# Altium schematic sheet SCH-00001-AB-01.SchDoc: POWER CIRCUIT
size 431 x 279 mm; Date: 17/09/2024; DrawnBy: VARUN CHAKRAVARTHY; Engineer: VARUN CHAKRAVARTHY; Organization: FINNIX; SheetNumber: 3; SheetTotal: 4; Time: 4:10 AM
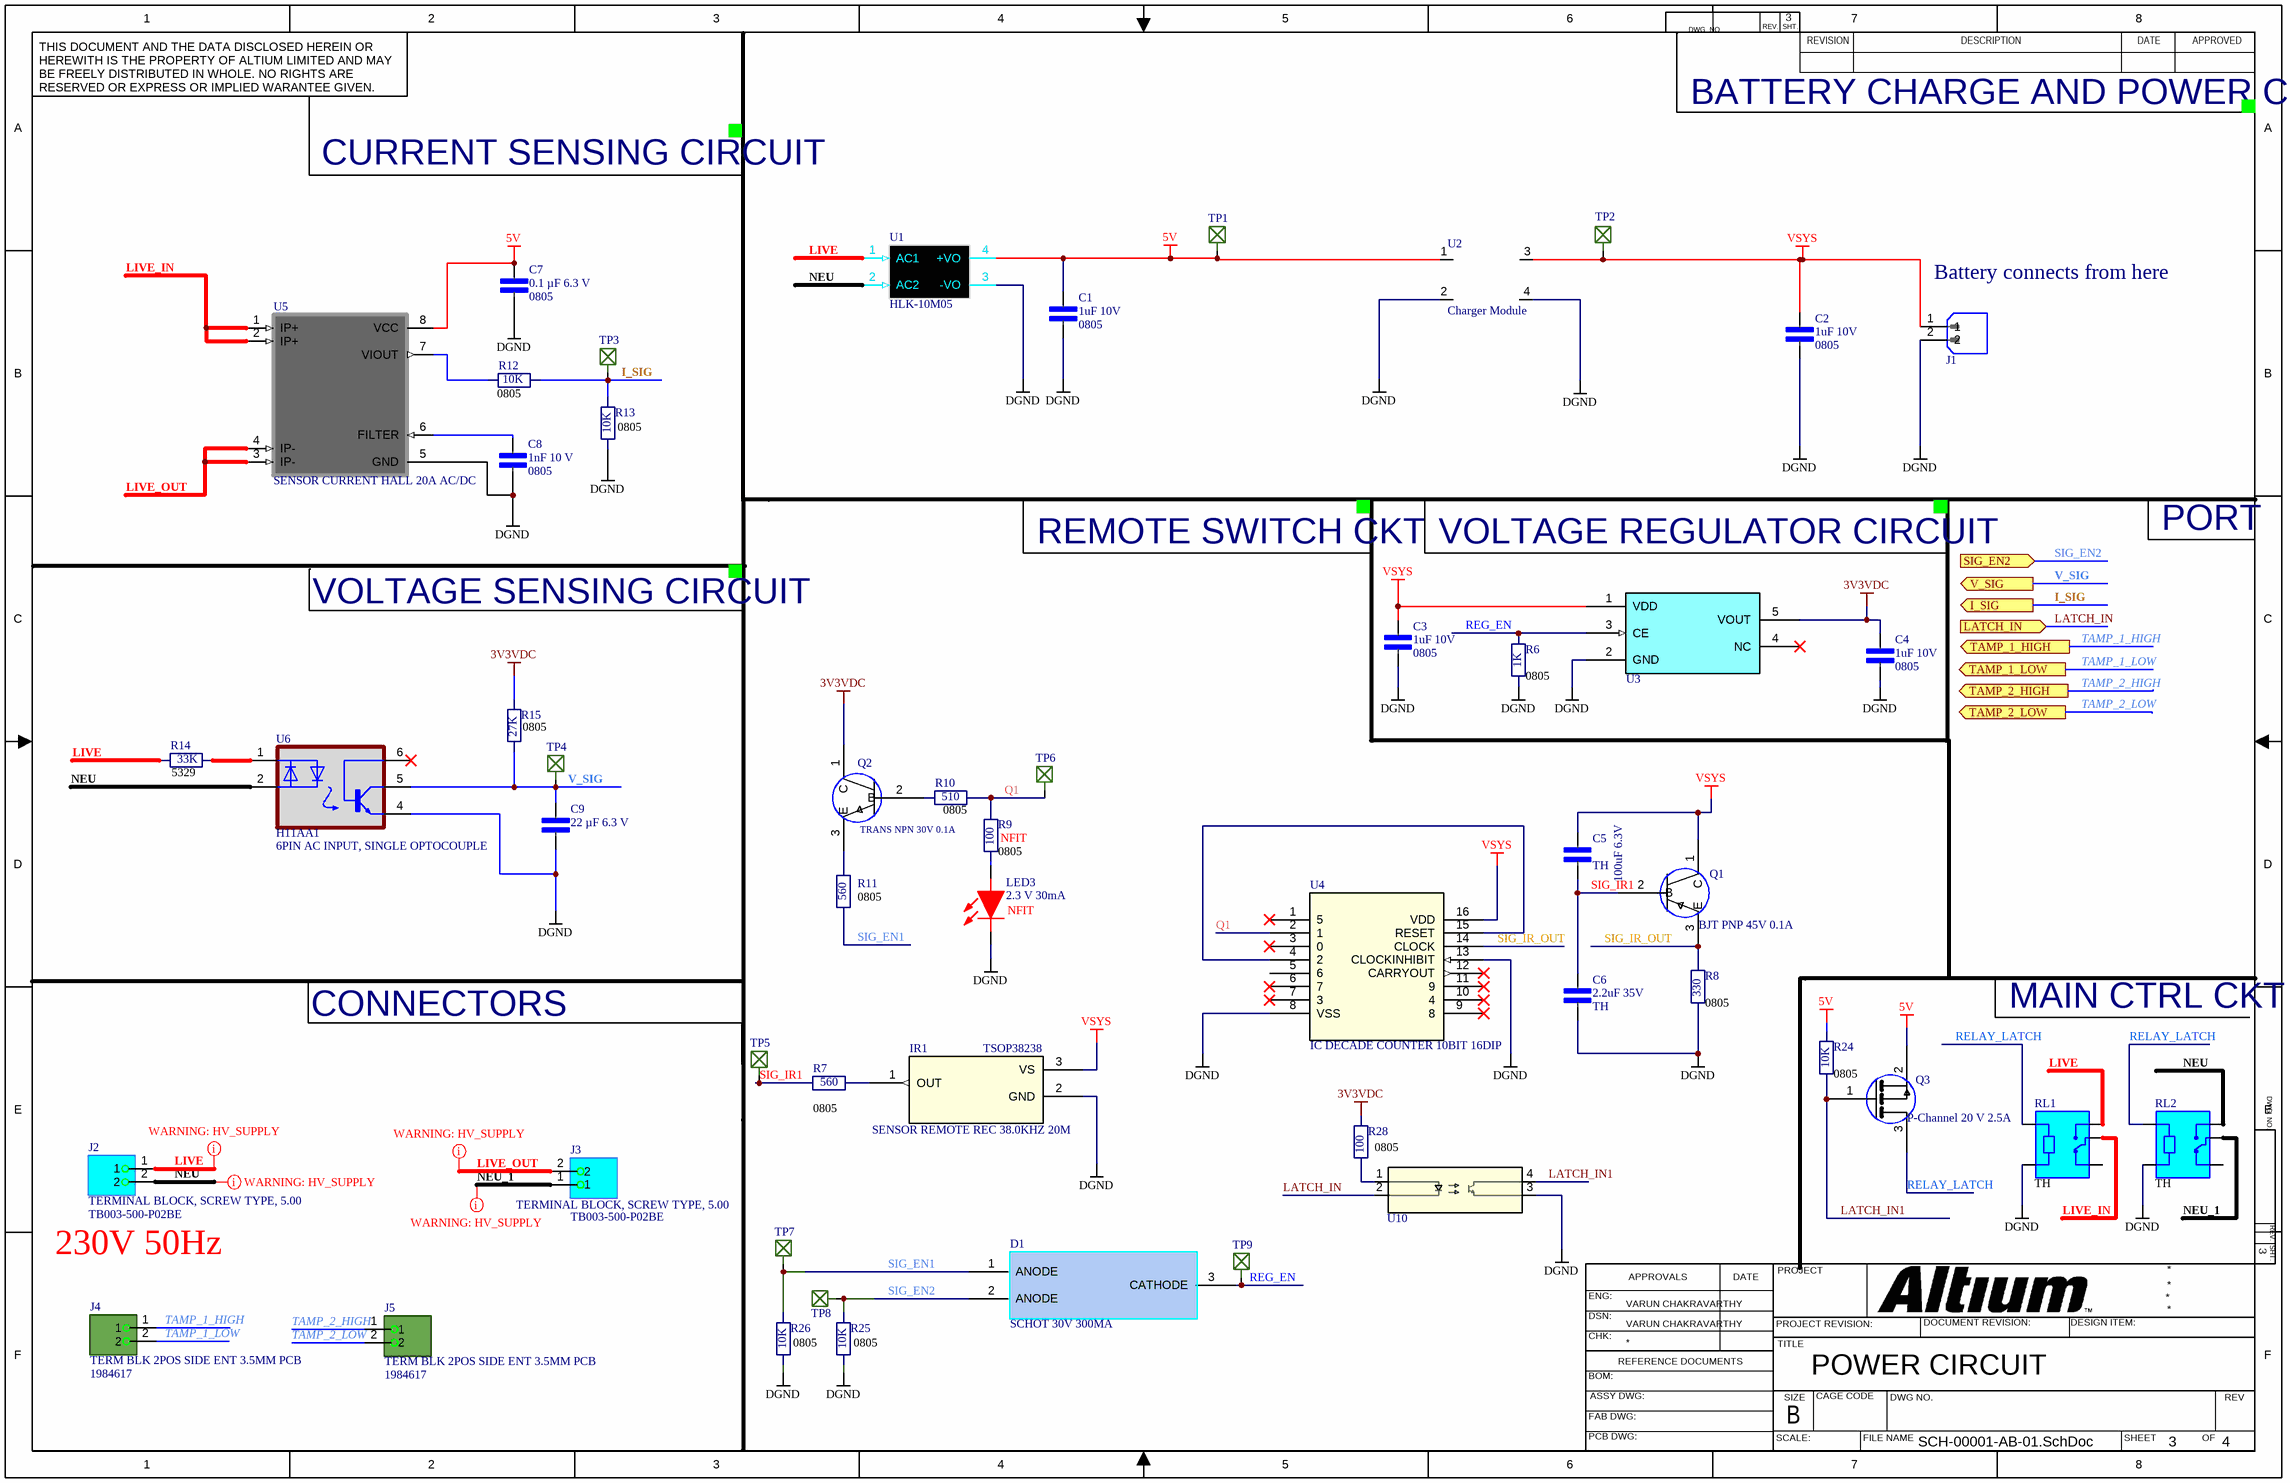
[diagram p0: SCH-00001-AB-01.SchDoc]

## Parts
C1  value 1uF 10V  Package: 0805  [CAP0805]  (hidden comment: GRM21BR71A105KA01L)
C2  value 1uF 10V  Package: 0805  [CAP0805]  (hidden comment: GRM21BR71A105KA01L)
C3  value 1uF 10V  Package: 0805  [CAP0805]  (hidden comment: GRM21BR71A105KA01L)
C4  value 1uF 10V  Package: 0805  [CAP0805]  (hidden comment: GRM21BR71A105KA01L)
C5  value 100uF 6.3V  Value 2: TH  [EC-A_PAN]  (hidden comment: ECA-0JM101)
C6  value 2.2uF 35V  Value 2: TH  [CAP_RN_10X12P5_NCH]  (hidden comment: UPX1V2R2MPD)
C7  value 0.1 µF 6.3 V  Value 2: 0805  [CAP0805]  (hidden comment: 08056D104KAT2A)
C8  value 1nF 10 V  Value 2: 0805  [CAP0805]  (hidden comment: C0805C102K8RAC7800)
C9  value 22 µF 6.3 V  [CAP0805]  (hidden comment: CL21A226KQCLRNC)
D1  value SCHOT 30V 300MA  [SOT-323_2P2X1P35X1P3_STM-M]  (hidden comment: BAT30CWFILM)
IR1  TSOP38238  value SENSOR REMOTE REC 38.0KHZ 20M  [TSOP382]
J1  1053131102  [CON_1053131102]  (value not drawn)
J2  value TERMINAL BLOCK, SCREW TYPE, 5.00  [CUI_TB003-500-P02BE]  (hidden comment: TB003-500-P02BE)
J3  value TERMINAL BLOCK, SCREW TYPE, 5.00  [CUI_TB003-500-P02BE]  (hidden comment: TB003-500-P02BE)
J4  value TERM BLK 2POS SIDE ENT 3.5MM PCB  [PHOENIX_1984617]  (hidden comment: 1984617)
J5  value TERM BLK 2POS SIDE ENT 3.5MM PCB  [PHOENIX_1984617]  (hidden comment: 1984617)
LED3  value 2.3 V 30mA  FIT/NFIT: NFIT  [LEDM2214X140N]  (hidden comment: LS M676-Q2S1-1-Z)
Q1  value BJT PNP 45V 0.1A  [TO-92-3L_5P33X5P2_ONS]  (hidden comment: BC557ATA)
Q2  value TRANS NPN 30V 0.1A  [TO-92-3L_5P33X5P2_ONS]  (hidden comment: BC548)
Q3  value P-Channel 20 V 2.5A  [SOT23_DMG2301U_DIO]  (hidden comment: DMG2301U-7)
R6  value 1K  Package: 0805  [RES0805]  (hidden comment: ERJ-6GEYJ102V)
R7  value 560  Package: 0805  [RES0805]  (hidden comment: ERA-6AEB561V)
R8  value 330  Package: 0805  [RES0805]  (hidden comment: ERA-6AEB331V)
R9  value 100  FIT/NFIT: NFIT  Package: 0805  [RES0805]  (hidden comment: ERA-6AEB101V)
R10  value 510  Package: 0805  [RES0805]  (hidden comment: ERA-6AEB511V)
R11  value 560  Package: 0805  [RES0805]  (hidden comment: ERA-6AEB561V)
R12  value 10K  Package: 0805  [RES0805]  (hidden comment: ERA-6AEB103V)
R13  value 10K  Package: 0805  [RES0805]  (hidden comment: ERA-6AEB103V)
R14  value 33K  Package: 5329  [RES_SMF5_TYCO_TYC]  (hidden comment: SMF533KJT)
R15  value 27K  Package: 0805  [RES0805]  (hidden comment: ERJ-6GEYJ273V)
R24  value 10K  Package: 0805  [RES0805]  (hidden comment: ERA-6AEB103V)
R25  value 10K  Package: 0805  [RES0805]  (hidden comment: ERA-6AEB103V)
R26  value 10K  Package: 0805  [RES0805]  (hidden comment: ERA-6AEB103V)
R28  value 100  Package: 0805  [RES0805]  (hidden comment: ERJ-6GEYJ101V)
RL1  Package: TH  [RELAY_SRD-05VDC-SL-C]  (hidden comment: SRD-05VDC-SL-C)
RL2  Package: TH  [RELAY_SRD-05VDC-SL-C]  (hidden comment: SRD-05VDC-SL-C)
TP1  TEST point  [TEST_POINT]  (value not drawn)
TP2  TEST point  [TEST_POINT]  (value not drawn)
TP3  TEST point  [TEST_POINT]  (value not drawn)
TP4  TEST point  [TEST_POINT]  (value not drawn)
TP5  TEST point  [TEST_POINT]  (value not drawn)
TP6  TEST point  [TEST_POINT]  (value not drawn)
TP7  TEST point  [TEST_POINT]  (value not drawn)
TP8  TEST point  [TEST_POINT]  (value not drawn)
TP9  TEST point  [TEST_POINT]  (value not drawn)
U1  HLK-10M05  [CONV_HLK-10M05]
U2  value Charger Module  [TP5100_MODULE]  (hidden comment: TP5100)
U3  RP170N331D-TR-FE  [SOT-23-5SC-74A_PE-SOT-23-5-180326_NMD-M]  (value not drawn)
U4  value IC DECADE COUNTER 10BIT 16DIP  [DIP794W45P254L1969H508Q16]  (hidden comment: CD4017BE)
U5  value SENSOR CURRENT HALL 20A AC/DC  [SOIC127P600X175-8N]  (hidden comment: ACS712ELCTR-20A-T)
U6  value 6PIN AC INPUT, SINGLE OPTOCOUPLE  [DIP762W50P254L730H410Q6]  (hidden comment: H11AA1)
U10  PC81710NIP1B  [SOP_PC8171_SCT-M]  (value not drawn)

## Ports
I_SIG (out, see SCH-00001-AA-01[2A], SCH-00001-AC-01[4A]), LATCH_IN (in, see SCH-00001-AA-01[2B], SCH-00001-AC-01[4A]), SIG_EN2 (in, see SCH-00001-AA-01[2B], SCH-00001-AC-01[4A]), TAMP_1_HIGH (out, see SCH-00001-AA-01[2A], SCH-00001-AC-01[4A]), TAMP_1_LOW (out, see SCH-00001-AA-01[2B], SCH-00001-AC-01[4A]), TAMP_2_HIGH (out, see SCH-00001-AA-01[2B], SCH-00001-AC-01[4A]), TAMP_2_LOW (out, see SCH-00001-AA-01[2B], SCH-00001-AC-01[4B]), V_SIG (out, see SCH-00001-AA-01[2A], SCH-00001-AC-01[4A])

## Nets
3V3VDC: C4.1(+) Q2.1(C) R15.2 R28.2 U3.5(VOUT)
5V: C1.1(+) C7.1(+) Q3.2(2/S) R24.2 TP1.1(G) U1.4(+VO) U2.1(NO) U5.8(VCC)
DGND: C1.2(-) C2.2(-) C3.2(-) C4.2(-) C6.2(-) C7.2(-) C8.2(-) C9.2(-) IR1.2(GND) J1.2 LED3.1(K) R6.2 R8.1 R13.1 R25.1 R26.1 RL1.A2 RL2.A2 U1.3(-VO) U2.2(COM) U2.4(COM) U3.2(GND) U4.8(VSS) U4.13(CLOCKINHIBIT) U5.5(GND) U6.4(E) U10.3(EMITTER)
VSYS: C2.1(+) C3.1(+) C5.1(+) IR1.3(VS) J1.1 Q1.1(C) TP2.1(G) U2.3(NO) U3.1(VDD) U4.16(VDD)
I_SIG: R12.2 R13.2 TP3.1(G) ; port I_SIG
LATCH_IN: U10.2(CATHODE) ; port LATCH_IN
LATCH_IN1: Q3.1(1/G) R24.1 U10.4(COLLECTOR)
LIVE: J2.1 R14.1 RL1.NO U1.1(AC1)
LIVE_IN: RL1.COM U5.1(IP+) U5.2(IP+)
LIVE_OUT: J3.2 U5.3(IP-) U5.4(IP-)
NEU: J2.2 RL2.NO U1.2(AC2) U6.2(C/A)
NEU_1: J3.1 RL2.COM
Q1: R9.2 R10.2 TP6.1(G) U4.2(1)
REG_EN: D1.3(CATHODE) R6.1 TP9.1(G) U3.3(CE)
RELAY_LATCH: Q3.3(3/D) RL1.A1 RL2.A1
SIG_EN1: D1.1(ANODE) R11.1 R26.2 TP7.1(G)
SIG_EN2: D1.2(ANODE) R25.2 TP8.1(G) ; port SIG_EN2
SIG_IR1: C5.2(-) C6.1(+) Q1.2(B) R7.1 TP5.1(G)
SIG_IR_OUT: Q1.3(E) R8.2 U4.14(CLOCK)
TAMP_1_HIGH: J4.1 ; port TAMP_1_HIGH
TAMP_1_LOW: J4.2 ; port TAMP_1_LOW
TAMP_2_HIGH: J5.1 ; port TAMP_2_HIGH
TAMP_2_LOW: J5.2 ; port TAMP_2_LOW
V_SIG: C9.1(+) R15.1 TP4.1(G) U6.5(C) ; port V_SIG
NetC8_1: C8.1(+) U5.6(FILTER)
NetIR1_1: IR1.1(OUT) R7.2
NetLED3_2: LED3.2(A) R9.1
NetQ2_2: Q2.2(B) R10.1
NetQ2_3: Q2.3(E) R11.2
NetR12_1: R12.1 U5.7(VIOUT)
NetR14_2: R14.2 U6.1(A/C)
NetR28_1: R28.1 U10.1(ANODE)
NetU4_4: U4.4(2) U4.15(RESET)

Not connected (* = marked no-connect by the designer): RL1 NC; RL2 NC; U3 4(NC)*; U4 1(5)* 3(0)* 5(6) 6(7)* 7(3)* 9(8)* 10(4)* 11(9)* 12(CARRYOUT)*; U6 6(B)*

## Layout directives
mark named WARNING: HV_SUPPLY: LIVE, LIVE_OUT, NEU, NEU_1

## Notes on the sheet
- BATTERY CHARGE AND POWER CKT
- CURRENT SENSING CIRCUIT
- (near J1) Battery connects from here
- REMOTE SWITCH CKT
- VOLTAGE REGULATOR CIRCUIT
- PORT
- VOLTAGE SENSING CIRCUIT
- CONNECTORS
- MAIN CTRL CKT
- 230V 50Hz
- DWG. NO.
- REV.
- SHT.
- THIS DOCUMENT AND THE DATA DISCLOSED HEREIN OR HEREWITH IS THE PROPERTY OF ALTIUM LIMITED AND MAY BE FREELY DISTRIBUTED IN WHOLE. NO RIGHTS ARE RESERVED OR EXPRESS OR IMPLIED WARANTEE GIVEN.
- REVISION
- DESCRIPTION
- DATE
- APPROVED
- ENG:
- APPROVALS
- PROJECT
- DSN:
- CHK:
- REFERENCE DOCUMENTS
- PROJECT REVISION:
- TITLE
- DOCUMENT REVISION:
- DESIGN ITEM:
- BOM:
- FAB DWG:
- PCB DWG:
- ASSY DWG:
- SCALE:
- SIZE
- B
- CAGE CODE
- FILE NAME
- DWG NO.
- SHEET
- OF
- REV

## Library data of the parts
C1-C4 = GRM21BR71A105KA01L: 1 µF ±10% 10V Ceramic Capacitor X7R 0805 (2012 Metric); Manufacturer: Murata Electronics; FIT/NFIT: FIT; Manufacturer Part no.: GRM21BR71A105KA01L; Distributor 1: digikey; Distributor 1 Part no.: 490-1695-1-ND; Price: ₹10.06; Price (Quantity): ₹3.30250(100+); Date drawn: 01/09/24; Drawn by: Varun Chakravarthy; Distributor 2: *; Distributor 2 part no.: *; Reference(datasheet): https://search.murata.co.jp/Ceramy/image/img/A01X/G101/ENG/GRM21BR71A105KA01-01.pdf; ComponentLink1Description: Reference Product Link; ComponentLink1URL: https://www.digikey.in/en/products/detail/murata-electronics/GRM21BR71A105KA01L/586695; Supplier 1: Future Electronics; Supplier Part Number 1: 5623319
C5 = ECA-0JM101: 100 µF 6.3 V Aluminum Electrolytic Capacitors Radial, Can 2000 Hrs @ 85°C; Manufacturer: Panasonic Electronic Components; FIT/NFIT: FIT; Manufacturer Part no.: ECA-0JM101; Distributor 1: Digikey; Distributor 1 Part no.: 478-08056D104KAT2ACT-ND; Price: ₹17.60; Price (Quantity): ₹5.75005(200+); Date drawn: 12/09/2024; Drawn by: Varun Chakravarthy; Distributor 2: *; Distributor 2 part no.: *; Reference(datasheet): https://mm.digikey.com/Volume0/opasdata/d220001/medias/docus/2452/ECA-xxM%20Series%2CTypeA.pdf; ComponentLink1Description: Reference Product link; ComponentLink1URL: https://www.digikey.in/en/products/detail/panasonic-electronic-components/ECA-0JM101/244970; Supplier 1: Mouser; Supplier Part Number 1: 667-ECA-0JM101; Supplier 2: Mouser; Supplier Part Number 2: 667-ECA-0JM101I; Supplier 3: Mouser; Supplier Part Number 3: 667-ECA-0JM101B
C6 = UPX1V2R2MPD: 2.2 µF 35 V Aluminum Electrolytic Capacitors Radial, Can 20000 Hrs @ 105°C; Manufacturer: Nichicon; FIT/NFIT: FIT; Manufacturer Part no.: UPX1V2R2MPD; Distributor 1: Digikey; Distributor 1 Part no.: 493-15889-ND; Price: ₹67.89; Price (Quantity): ₹27.71930(200+); Date drawn: 12/09/2024; Drawn by: Varun Chakravarthy; Distributor 2: *; Distributor 2 part no.: *; Reference(datasheet): https://media.digikey.com/pdf/Data%20Sheets/Nichicon%20PDFs/UPX.pdf; ComponentLink1Description: Reference Product link; ComponentLink1URL: https://www.digikey.in/en/products/detail/nichicon/UPX1V2R2MPD/4994046; Supplier 1: Digikey; Supplier Part Number 1: 493-15889-ND; Supplier 2: Digikey; Supplier Part Number 2: 493-11908-1-ND
C7 = 08056D104KAT2A: 0.1 µF ±10% 6.3V Ceramic Capacitor X5R 0805 (2012 Metric); Manufacturer: KYOCERA AVX; FIT/NFIT: FIT; Manufacturer Part no.: 08056D104KAT2A; Distributor 1: digikey; Distributor 1 Part no.: 478-08056D104KAT2ACT-ND; Price: ₹8.38; Price (Quantity): ₹2.12900(100+); Date drawn: 04/07/24; Drawn by: Varun Chakravarthy; Distributor 2: *; Distributor 2 part no.: *; Reference(datasheet): https://datasheets.kyocera-avx.com/cx5r.pdf; ComponentLink1Description: Reference Product link; ComponentLink1URL: https://www.digikey.in/en/products/detail/kyocera-avx/08056D104KAT2A/11568656; Supplier 1: Digikey; Supplier Part Number 1: 478-08056D104KAT2ACT-ND
C8 = C0805C102K8RAC7800: 1000 pF ±10% 10V Ceramic Capacitor X7R 0805 (2012 Metric); Manufacturer: KEMET; FIT/NFIT: FIT; Manufacturer Part no.: C0805C102K8RAC7800; Distributor 1: Digikey; Distributor 1 Part no.: 399-C0805C102K8RAC7800CT-ND; Price: ₹10.06; Price (Quantity): ₹3.31930(100+); Date drawn: 16/09/24; Drawn by: Varun Chakravarthy; Distributor 2: *; Distributor 2 part no.: *; Reference(datasheet): https://content.kemet.com/datasheets/KEM_C1002_X7R_SMD.pdf; ComponentLink1Description: Reference Product link; ComponentLink1URL: https://www.digikey.in/en/products/detail/kyocera-avx/08056D104KAT2A/11568656; Supplier 1: Digikey; Supplier Part Number 1: 478-08056D104KAT2ACT-ND
C9 = CL21A226KQCLRNC: 22 µF ±10% 6.3V Ceramic Capacitor X5R 0805 (2012 Metric); Manufacturer: Samsung Electro-Mechanics; FIT/NFIT: FIT; Value 2: 0805; Manufacturer Part no.: CL21A226KQCLRNC; Distributor 1: digikey; Distributor 1 Part no.: 478-08056D104KAT2ACT-ND; Price: ₹9.22; Price (Quantity): ₹2.81640100+); Date drawn: 03/9/2024; Drawn by: Varun Chakravarthy; Distributor 2: *; Distributor 2 part no.: *; Reference(datasheet): https://weblib.samsungsem.com/mlcc/mlcc-ec-data-sheet.do?partNumber=CL05Y105KP6VPN; ComponentLink1Description: Reference Product link; ComponentLink1URL: https://www.digikey.in/en/products/detail/samsung-electro-mechanics/CL21A226KQCLRNC/5961171; Supplier 1: Avnet; Supplier Part Number 1: CL21A226KQCLRNC
D1 = BAT30CWFILM: Remote Receiver Sensor 38.0kHz 20m Through Hole; Manufacturer: STMicroelectronics; FIT/NFIT: FIT; Value 2: TH; Manufacturer Part no.: BAT30CWFILM; Distributor 1: Digikey; Distributor 1 Part no.: 497-5550-1-ND; Price: ₹20.12; Price (Quantity): ₹6.62180(100+); Date drawn: 12/07/24; Drawn by: Varun Chakravarthy; Reference(datasheet): https://www.st.com/content/ccc/resource/technical/document/datasheet/b5/44/50/dc/a4/84/48/70/CD00126118.pdf/files/CD00126118.pdf/jcr:content/translations/en.CD00126118.pdf; ComponentLink1Description: Reference Product link; ComponentLink1URL: https://www.digikey.in/en/products/detail/stmicroelectronics/BAT30CWFILM/1207017; ComponentLink2Description: Reference Product link2; ComponentLink2URL: https://robocraze.com/products/tsop-1838b-small?_pos=1&_sid=ae64a7e59&_ss=r; Supplier 1: Future Electronics; Supplier Part Number 1: 3034833
IR1 = TSOP38238: Remote Receiver Sensor 38.0kHz 20m Through Hole; Manufacturer: KYOCERA AVX; FIT/NFIT: FIT; Value 2: TH; Manufacturer Part no.: TSOP38238; Distributor 1: digikey; Distributor 1 Part no.: 751-1227-ND; Price: ₹91.36; Price (Quantity): ₹50.28360(100+); Date drawn: 04/07/24; Drawn by: Varun Chakravarthy; Distributor 2: Robocraze; Distributor 2 part no.: TSOP 1838B small; Reference(datasheet): https://www.vishay.com/docs/82491/tsop382.pdf; ComponentLink1Description: Reference Product link; ComponentLink1URL: https://www.digikey.in/en/products/detail/texas-instruments/CD4017BE/67253; Supplier 1: Digikey; Supplier Part Number 1: 478-08056D104KAT2ACT-ND; ComponentLink2Description: Reference Product link2; ComponentLink2URL: https://robocraze.com/products/tsop-1838b-small?_pos=1&_sid=ae64a7e59&_ss=r
J1 = 1053131102: Connector Header Through Hole, Right Angle 2 position 0.049" (1.25mm); Manufacturer: Molex; FIT/NFIT: FIT; Distributor 1: Digikey; Distributor 1 Part no.: WM16893-ND; Price: ₹84.68; Price (Quantity): ₹58.42810(300+); Date drawn: 6/10/24; Drawn by: Varun; Distributor 2: *; Distributor 2 part no.: *; Verified by: *; Reference(datasheet): https://tools.molex.com/pdm_docs/ps/PS-105300-100-001.pdf; ComponentLink1Description: Reference Product Link; ComponentLink1URL: https://www.digikey.in/en/products/detail/molex/1053131102/7693174; Supplier 1: Mouser; Supplier Part Number 1: 538-105313-1102
J2 J3 = TB003-500-P02BE: 2 Position Wire to Board Terminal Block Horizontal with Board 0.197" (5.00mm) Through Hole; Manufacturer: Same Sky; FIT/NFIT: FIT; Distributor 1: Digikey; Distributor 1 Part no.: 102-6161-ND; Price: ₹29.34000; Price (Quantity): ₹29.34000(100+); Date drawn: 26/09/24; Drawn by: Varun Chakravarthy; Distributor 2: *; Distributor 2 part no.: *; Reference(datasheet): https://www.sameskydevices.com/product/resource/tb003-500.pdf; ComponentLink1Description: Reference Product Link; ComponentLink1URL: https://www.digikey.in/en/products/detail/same-sky-formerly-cui-devices/TB003-500-P02BE/10064085; Supplier 1: Digikey; Supplier Part Number 1: 277-1721-ND; Supplier 2: Digikey; Supplier Part Number 2: 277-1721-ND; Supplier 3: Digikey; Supplier Part Number 3: 277-1721-ND; Manufacturer Part no.: TB003-500-P02BE
J4 J5 = 1984617: 2 Position Wire to Board Terminal Block Horizontal with Board 0.138" (3.50mm) Through Hole; Manufacturer: Phoenix Contact; FIT/NFIT: FIT; Distributor 1: Digikey; Distributor 1 Part no.: 277-1721-ND; Price: ₹36.88000; Price (Quantity): ₹36.88000(100+); Date drawn: 17/09/24; Drawn by: Varun Chakravarthy; Distributor 2: *; Distributor 2 part no.: *; Reference(datasheet): https://mm.digikey.com/Volume0/opasdata/d220001/medias/docus/2450/Combicon%20Compact%20Series.pdf; ComponentLink1Description: Reference Product Link; ComponentLink1URL: https://www.digikey.in/en/products/detail/isocom-components-2004-ltd/H11AA1/21185110; Supplier 1: Digikey; Supplier Part Number 1: 277-1721-ND; Supplier 2: Digikey; Supplier Part Number 2: 277-1721-ND; Supplier 3: Digikey; Supplier Part Number 3: 277-1721-ND; Manufacturer Part no.: 1984617
LED3 = LS M676-Q2S1-1-Z: Standard LEDs - SMD Super Red, 633nm 224mcd, 20mA; Manufacturer: ams OSRAM; Date drawn: 12/072023; Value1: 10%; Distributor 1: Mouser; Distributor 1 part no.: 720-LSM676-Q2S1-1-Z; Distributor 2 part no.: *; Distributor 2: *; Reference (datatsheet): https://www.mouser.in/ProductDetail/ams-OSRAM/LS-M676-Q2S1-1-Z?qs=sGAEpiMZZMuCm2JlHBGefsr41A2gKzLGVzDa1YgO91o%3D; Drawn by: Varun; Verified by: *; Marturion Part No.: *; Price: ₹36.70; Price (Quantity): ₹15.93(+100); Value2: *; Package: 0805; Manufacturer part no.: LS M676-Q2S1-1-Z; Supplier 1: Mouser; Supplier Part Number 1: 720-LSM676-Q2S1-1-Z
Q1 = BC557: P-Channel 20 V 2.5A (Ta) 800mW (Ta) Surface Mount SOT-23-3; Manufacturer: onsemi; FIT/NFIT: FIT; Manufacturer Part no.: BC557ATA; Distributor 1: Digikey; Distributor 1 Part no.: BC557ATACT-ND; Price: ₹24.31; Price (Quantity): ₹9.27890(100+); Date drawn: 12/09/24; Drawn by: Varun Chakravarthy; Distributor 2: *; Distributor 2 part no.: *; Reference(datasheet): https://www.onsemi.com/pdf/datasheet/bc556bta-d.pdf; ComponentLink1Description: Reference Product Link; ComponentLink1URL: https://robu.in/product/bc557-pnp-transistor-pack-of-20/; Supplier 1: Arrow Electronics; Supplier Part Number 1: BCW30LT1G; Supplier 2: Avnet; Supplier Part Number 2: BC557ATA
Q2 = BC548: Bipolar (BJT) Transistor NPN 30 V 100 mA 300MHz 500 mW Through Hole TO-92-3; Manufacturer: Fairchild Semiconductor; FIT/NFIT: FIT; Manufacturer Part no.: BC548; Distributor 1: Digikey; Distributor 1 Part no.: 2156-BC548-FS-ND; Price: -; Price (Quantity): ₹4.19100 (bulk); Date drawn: 12/09/24; Drawn by: Varun Chakravarthy; Distributor 2: *; Distributor 2 part no.: *; Reference(datasheet): https://rocelec.widen.net/view/pdf/q1kc0zm1fe/FAIRS24942-1.pdf?t.download=true&u=5oefqw; ComponentLink1Description: Reference Product Link; ComponentLink1URL: https://robu.in/product/bc557-pnp-transistor-pack-of-20/; Supplier 1: Mouser; Supplier Part Number 1: 637-BC548A; Supplier 2: Mouser; Supplier Part Number 2: 637-BC548BBK; Supplier 3: Arrow Electronics; Supplier Part Number 3: BC548CBK
Q3 = DMG2301U-7: P-Channel 20 V 2.5A (Ta) 800mW (Ta) Surface Mount SOT-23-3; Manufacturer: Diodes Incorporated; FIT/NFIT: FIT; Manufacturer Part no.: DMG2301U-7; Distributor 1: digikey; Distributor 1 Part no.: DMG2301U-7DICT-ND; Price: ₹25.15; Price (Quantity): ₹9.06090(100+); Date drawn: 05/09/24; Drawn by: Varun Chakravarthy; Distributor 2: *; Distributor 2 part no.: *; Reference(datasheet): https://mm.digikey.com/Volume0/opasdata/d220001/medias/docus/645/DMG2301U.pdf; ComponentLink1Description: Reference Product Link; ComponentLink1URL: https://www.digikey.in/en/products/detail/murata-electronics/GRM21BR71A105KA01L/586695; Supplier 1: Future Electronics; Supplier Part Number 1: 5623319
R6 = ERJ-6GEYJ102V: 1 kOhms ±5% 0.125W, 1/8W Chip Resistor 0805 (2012 Metric) Automotive AEC-Q200 Thick Film; Manufacturer: Panasonic Electronic Components; Manufacturer Part no.: P1.0KACT-ND; Dranw by: Varun; FIT/NFIT: FIT; Distributor 1: Digikey; Distributor 1 Part no.: 10-ERA-6AEB3830VCT-ND; Price: ₹8.38; Price (Quantity): ₹1.76020 (100+); Date drawn: 1/9/2024; Distributor 2: *; Distributor 2 part no.: *; Verified by: *; Reference(datasheet): https://industrial.panasonic.com/cdbs/www-data/pdf/RDA0000/AOA0000C301.pdf; ComponentLink1Description: Reference Product Link; ComponentLink1URL: https://www.digikey.in/en/products/detail/panasonic-electronic-components/ERJ-6GEYJ102V/83014; Supplier 1: Future Electronics; Supplier Part Number 1: 9031152
R7 R11 = ERA-6AEB561V: 560 Ohms ±0.1% 0.125W, 1/8W Chip Resistor 0805 (2012 Metric) Automotive AEC-Q200 Thin Film; Manufacturer: Panasonic Electronic Components; Dranw by: Varun; FIT/NFIT: FIT; Manufacturer Part no.: ERA-6AEB561V; Distributor 1: Digikey; Distributor 1 Part no.: P560DACT-ND; Price: ₹10.90; Price (Quantity): ₹5.89250 (100+); Date drawn: 12/9/2024; Distributor 2: *; Distributor 2 part no.: *; Verified by: *; Reference(datasheet): https://industrial.panasonic.com/cdbs/www-data/pdf/RDM0000/AOA0000C307.pdf; ComponentLink1Description: Reference Product Link; ComponentLink1URL: https://www.digikey.in/en/products/detail/panasonic-electronic-components/ERA-6AEB561V/1465742; Supplier 1: Future Electronics; Supplier Part Number 1: 6065350
R8 = ERA-6AEB331V: 330 Ohms ±0.1% 0.125W, 1/8W Chip Resistor 0805 (2012 Metric) Automotive AEC-Q200 Thin Film; Manufacturer: Panasonic Electronic Components; Dranw by: Varun; FIT/NFIT: FIT; Manufacturer Part no.: ERA-6AEB331V; Distributor 1: Digikey; Distributor 1 Part no.: P330DACT-ND; Price: ₹10.90; Price (Quantity): ₹5.89250 (100+); Date drawn: 12/9/2024; Distributor 2: *; Distributor 2 part no.: *; Verified by: *; Reference(datasheet): https://industrial.panasonic.com/cdbs/www-data/pdf/RDM0000/AOA0000C307.pdf; ComponentLink1Description: Reference Product Link; ComponentLink1URL: https://www.digikey.in/en/products/detail/panasonic-electronic-components/ERA-6AEB331V/1465736; Supplier 1: Future Electronics; Supplier Part Number 1: 7176711
R9 = ERA-6AEB101V: 100 Ohms ±0.1% 0.125W, 1/8W Chip Resistor 0805 (2012 Metric) Automotive AEC-Q200 Thin Film; Manufacturer: Panasonic Electronic Components; Dranw by: Varun; Manufacturer Part no.: ERA-6AEB101V; Distributor 1: Digikey; Distributor 1 Part no.: P100DACT-ND; Price: ₹10.90; Price (Quantity): ₹5.89250 (100+); Date drawn: 12/9/2024; Distributor 2: *; Distributor 2 part no.: *; Verified by: *; Reference(datasheet): https://industrial.panasonic.com/cdbs/www-data/pdf/RDM0000/AOA0000C307.pdf; ComponentLink1Description: Reference Product Link; ComponentLink1URL: https://www.digikey.in/en/products/detail/panasonic-electronic-components/ERA-6AEB101V/1465724; Supplier 1: Mouser; Supplier Part Number 1: 667-ERA-6AEB101V
R10 = ERA-6AEB511V: 510 Ohms ±0.1% 0.125W, 1/8W Chip Resistor 0805 (2012 Metric) Automotive AEC-Q200 Thin Film; Manufacturer: Panasonic Electronic Components; Dranw by: Varun; FIT/NFIT: FIT; Manufacturer Part no.: ERA-6AEB511V; Distributor 1: Digikey; Distributor 1 Part no.: P510DACT-ND; Price: ₹10.90; Price (Quantity): ₹5.89250 (100+); Date drawn: 12/9/2024; Distributor 2: *; Distributor 2 part no.: *; Verified by: *; Reference(datasheet): https://industrial.panasonic.com/cdbs/www-data/pdf/RDM0000/AOA0000C307.pdf; ComponentLink1Description: Reference Product Link; ComponentLink1URL: https://www.digikey.in/en/products/detail/panasonic-electronic-components/ERA-6AEB511V/1465741; Supplier 1: Mouser; Supplier Part Number 1: 667-ERA-6AEB511V
R12 R13 R24-R26 = ERA-6AEB103V: 10 kOhms ±0.1% 0.125W, 1/8W Chip Resistor 0805 (2012 Metric) Automotive AEC-Q200 Thin Film; Manufacturer: Panasonic Electronic Components; Dranw by: Varun; FIT/NFIT: FIT; Manufacturer Part no.: ERA-6AEB103V; Distributor 1: Digikey; Distributor 1 Part no.: P10KDACT-ND; Price: ₹10.90; Price (Quantity): ₹5.89250 (100+); Date drawn: 1/9/2024; Distributor 2: *; Distributor 2 part no.: *; Verified by: *; Reference(datasheet): https://industrial.panasonic.com/cdbs/www-data/pdf/RDM0000/AOA0000C307.pdf; ComponentLink1Description: Reference Product Link; ComponentLink1URL: https://www.digikey.in/en/products/detail/panasonic-electronic-components/ERA-6AEB103V/1465773; Supplier 1: Future Electronics; Supplier Part Number 1: 5028531
R14 = SMF533KJT: 33 kOhms ±5% 5W Chip Resistor 5329 (13573 Metric), J-Lead Flame Retardant Coating, Safety Metal Film; Manufacturer: TE Connectivity Passive Product; Dranw by: Varun; FIT/NFIT: FIT; Manufacturer Part no.: SMF533KJT; Distributor 1: Digikey; Distributor 1 Part no.: A106035CT-ND; Price: ₹92.20; Price (Quantity): ₹55.94150 (100+); Date drawn: 17/9/2024; Distributor 2: *; Distributor 2 part no.: *; Verified by: *; Reference(datasheet): https://www.te.com/usa-en/product-4-1879234-4.datasheet.pdf; ComponentLink1Description: Reference Product Link; ComponentLink1URL: https://www.digikey.in/en/products/detail/te-connectivity-passive-product/SMF533KJT/2367121; Supplier 1: Digikey; Supplier Part Number 1: A106035CT-ND; Supplier 2: Digikey; Supplier Part Number 2: A106035CT-ND
R15 = ERJ-6GEYJ273V: 27 kOhms ±5% 0.125W, 1/8W Chip Resistor 0805 (2012 Metric) Automotive AEC-Q200 Thick Film; Manufacturer: Panasonic Electronic Components; Dranw by: Varun; FIT/NFIT: FIT; Manufacturer Part no.: ERJ-6GEYJ273V; Distributor 1: Digikey; Distributor 1 Part no.: P27KACT-ND; Price: ₹8.38; Price (Quantity): ₹1.76020 (100+); Date drawn: 1/9/2024; Distributor 2: *; Distributor 2 part no.: *; Verified by: *; Reference(datasheet): https://industrial.panasonic.com/cdbs/www-data/pdf/RDA0000/AOA0000C301.pdf; ComponentLink1Description: Reference Product Link; ComponentLink1URL: https://www.digikey.in/en/products/detail/panasonic-electronic-components/ERJ-6GEYJ273V/83082?s=N4IgTCBcDaIKICUBSBaAbAcTgTSWA7AMwBqIAugL5A; Supplier 1: Future Electronics; Supplier Part Number 1: 4054913
R28 = ERJ-6GEYJ101V: 100 Ohms ±5% 0.125W, 1/8W Chip Resistor 0805 (2012 Metric) Automotive AEC-Q200 Thick Film; Manufacturer: Panasonic Electronic Components; Dranw by: Varun; FIT/NFIT: FIT; Manufacturer Part no.: ERJ-6GEYJ101V; Distributor 1: Digikey; Distributor 1 Part no.: P100ACT-ND; Price: ₹8.38; Price (Quantity): ₹1.76020(100+); Date drawn: 1/9/2024; Distributor 2: *; Distributor 2 part no.: *; Verified by: *; Reference(datasheet): https://industrial.panasonic.com/cdbs/www-data/pdf/RDA0000/AOA0000C301.pdf; ComponentLink1Description: Reference Product Link; ComponentLink1URL: https://www.digikey.in/en/products/detail/panasonic-electronic-components/ERJ-6GEYJ101V/89678; Supplier 1: Future Electronics; Supplier Part Number 1: 9028505
RL1 RL2 = SRD-05VDC-SL-C: 5V Trigger Relay Module; Manufacturer: SongLe; Dranw by: Varun; FIT/NFIT: FIT; Manufacturer Part no.: SRD-05VDC-SL-C; Distributor 1: Winsource; Distributor 1 Part no.: 340142-SRD-05VDC-SL-C; Price: $0.277; Price (Quantity): $0.277 (100+); Date drawn: 12/9/2024; Distributor 2: *; Distributor 2 part no.: *; Verified by: *; Reference(datasheet): https://www.snapeda.com/parts/SRD-05VDC-SL-C/Songle%20Relay/datasheet/; ComponentLink1Description: Reference Product Link; ComponentLink1URL: https://www.digikey.in/en/products/detail/panasonic-electronic-components/ERA-6AEB561V/1465742
TP1-TP9 = TP
U1 = HLK-10M05: AC to DC Power Supply Module; Manufacturer: Hi-link; FIT/NFIT: FIT; Distributor 1: ElectroncisComp; Distributor 1 Part no.: EC-4693; Price: ₹199; Price (Quantity): ₹199(100+); Date drawn: 31/8/24; Drawn by: Varun; Distributor 2: *; Distributor 2 part no.: *; Verified by: *; Reference(datasheet): https://www.lcsc.com/datasheet/lcsc_datasheet_2305061443_HI-LINK-HLK-10M05_C403745.pdf; Manufacturer Part no.: HLK-10M05; ComponentLink1Description: Reference Product Link; ComponentLink1URL: https://www.electronicscomp.com/power-supply/power-supply-module/hi-link-power-supply-module/hlk-10m05-hi-link-5v-10w-ac-to-dc-power-supply-module
U2 = TP5100: 4.2v and 8.4v Dual One/Two Battery Protection Board; Manufacturer: Tap ower ASIC; FIT/NFIT: FIT; Manufacturer Part no.: TP5100; Distributor 1: ROBU; Distributor 1 Part no.: 62296; Price: ₹62; Price (Quantity): ₹62(100+); Date drawn: 10/07/24; Drawn by: Varun Chakravarthy; Distributor 2: *; Distributor 2 part no.: *; Reference(datasheet): https://voltiq.ru/datasheets/TP5100-datashhet.pdf; ComponentLink1Description: Reference Product Link; ComponentLink1URL: https://robu.in/product/tp5100-4-2v-8-4v-single-double-lithium-battery-charge-management-lion-battery-compatible-2a-charging-board/
U3 = RP170N331D-TR-FE: Linear Voltage Regulator IC Positive Fixed 1 Output 300mA SOT-23-5; Manufacturer: Nisshinbo Micro Devices Inc.; FIT/NFIT: FIT; Distributor 1: Digikey; Distributor 1 Part no.: 2129-RP170N331D-TR-FECT-ND; Price: ₹48.62; Price (Quantity): ₹30.81220(100+); Date drawn: 31/8/24; Drawn by: Varun; Distributor 2: *; Distributor 2 part no.: *; Verified by: *; Reference(datasheet): https://www.nisshinbo-microdevices.co.jp/en/pdf/datasheet/rp170-ea.pdf; ComponentLink1Description: Reference Product Link; ComponentLink1URL: https://www.digikey.in/en/products/detail/nisshinbo-micro-devices-inc/RP170N331D-TR-FE/10216995; Supplier 1: Digikey; Supplier Part Number 1: 2129-RP170N331D-TR-FECT-ND
U4 = CD4017BE: Counter IC Counter, Decade 1 Element 10 Bit Positive, Negative 16-PDIP; Manufacturer: Texas Instruments; FIT/NFIT: FIT; Value 2: TH; Manufacturer Part no.: CD4017BE; Distributor 1: digikey; Distributor 1 Part no.: 296-2037-5-ND; Price: ₹87.17; Price (Quantity): ₹60.75270 (100+); Date drawn: 08/09/24; Drawn by: Varun Chakravarthy; Distributor 2: Robocraze; Distributor 2 part no.: CD4017 - Decade Counter IC; Reference(datasheet): https://www.ti.com/lit/ds/symlink/cd4017b.pdf?HQS=dis-dk-null-digikeymode-dsf-pf-null-wwe&ts=1725798122865&ref_url=https%253A%252F%252Fwww.ti.com%252Fgeneral%252Fdocs%252Fsuppproductinfo.tsp%253FdistId%253D10%2526gotoUrl%253Dhttps%253A%252F%252Fwww.ti.com%252Flit%252Fgpn%252Fcd4017b; ComponentLink1Description: Reference Product link; ComponentLink1URL: https://www.digikey.in/en/products/detail/kyocera-avx/08056D104KAT2A/11568656; ComponentLink2Description: Reference Product link2; ComponentLink2URL: https://robocraze.com/products/decade-counter-ic-cd4017; Supplier 1: Mouser; Supplier Part Number 1: 595-CD4017BE
U5 = ACS712ELCTR-20A-T: Current Sensor 20A 1 Channel Hall Effect, Open Loop Bidirectional 8-SOIC (0.154", 3.90mm Width); Manufacturer: onsemi; FIT/NFIT: FIT; Manufacturer Part no.: ACS712ELCTR-20A-T; Distributor 1: Digikey; Distributor 1 Part no.: 620-1190-1-ND; Price: ₹317.68; Price (Quantity): ₹194.98210(100+); Date drawn: 16/09/24; Drawn by: Varun Chakravarthy; Distributor 2: *; Distributor 2 part no.: *; Reference(datasheet): https://www.allegromicro.com/~/media/Files/Datasheets/ACS712-Datasheet.ashx; ComponentLink1Description: Reference Product Link; ComponentLink1URL: https://robu.in/product/acs712-30a-range-current-sensor-module-hall-sensor/; Supplier 1: Arrow Electronics; Supplier Part Number 1: BCW30LT1G; Supplier 2: Avnet; Supplier Part Number 2: BC557ATA
U6 = H11AA1: Optoisolator Transistor with Base Output 5000Vrms 1 Channel 6-DIP; Manufacturer: Isocom Components 2004 LTD; FIT/NFIT: FIT; Manufacturer Part no.: H11AA1; Distributor 1: digikey; Distributor 1 Part no.: 58-H11AA1-ND; Price: ₹29.49416; Price (Quantity): ₹29.49416(100+); Date drawn: 16/09/24; Drawn by: Varun Chakravarthy; Distributor 2: *; Distributor 2 part no.: *; Reference(datasheet): https://www.vishay.com/docs/83608/83608.pdf; ComponentLink1Description: Reference Product Link; ComponentLink1URL: https://www.digikey.in/en/products/detail/isocom-components-2004-ltd/H11AA1/21185110; Supplier 1: Future Electronics; Supplier Part Number 1: 5411806; Supplier 2: Mouser; Supplier Part Number 2: 782-H11AA1; Supplier 3: Future Electronics; Supplier Part Number 3: 9187492; Supplier 4: Future Electronics; Supplier Part Number 4: 8266744; Supplier 5: Mouser; Supplier Part Number 5: 512-H11AA1SR2VM; Supplier 6: Digikey; Supplier Part Number 6: H11AA1TVM-ND; Supplier 7: Mouser; Supplier Part Number 7: 782-H11AA1-X007T; Supplier 8: Digikey; Supplier Part Number 8: H11AA1SM-ND; Supplier 9: Future Electronics; Supplier Part Number 9: 2034656; Supplier 10: Mouser; Supplier Part Number 10: 782-H11AA1-X006
U10 = PC81710NIP1B: Optoisolator Transistor Output 5000Vrms 1 Channel 4-SMD; Manufacturer: SHARP/Socle Technology; Dranw by: Varun; FIT/NFIT: FIT; Manufacturer Part no.: PC81710NIP1B; Distributor 1: Digikey; Distributor 1 Part no.: 1855-1014-1-ND; Price: ₹83.82; Price (Quantity): ₹39.43730(100+); Date drawn: 05/07/24; Distributor 2: *; Distributor 2 part no.: *; Verified by: *; Reference(datasheet): http://www.socle-tech.com/doc/IC%20Channel%20Product/Optoelectronic%20Components/Photocoupler/PC8171_NIP1B_ED-16P023.pdf; ComponentLink1Description: Product link; ComponentLink1URL: https://www.digikey.in/en/products/detail/sharp-socle-technology/PC81710NIP1B/7798258; Supplier 1: Mouser; Supplier Part Number 1: 852-PC81710NIP1B